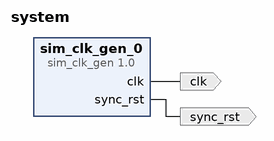
[diagram p0: block diagram of the top level]
# Vivado block design system, xc7a50tcsg324-1, Vivado 2017.2
create_bd_design system

create_bd_port -dir O -type clk clk
create_bd_port -dir O -type rst sync_rst

create_bd_cell -type ip -vlnv xilinx.com:ip:sim_clk_gen:1.0 sim_clk_gen_0
set_property -dict {CONFIG.INITIAL_RESET_CLOCK_CYCLES 10 CONFIG.RESET_POLARITY ACTIVE_LOW} [get_bd_cells sim_clk_gen_0]

# ---- connections ----

connect_bd_net [get_bd_pins sim_clk_gen_0/clk] [get_bd_ports clk]
connect_bd_net [get_bd_pins sim_clk_gen_0/sync_rst] [get_bd_ports sync_rst]

validate_bd_design
save_bd_design
